# EasyEDA Pro project ProPrj_40HZ-AMSAD_2024-06-22.epro

# Schematic Schematic1
Create Date: 2024-05-20; Page Name: P1; Project Name: 阿尔法波平板; Schematic Name: Schematic1; Update Date: 2024-05-21; Company: 嘉立创EDA; Page Size: A4; Version: V1.0
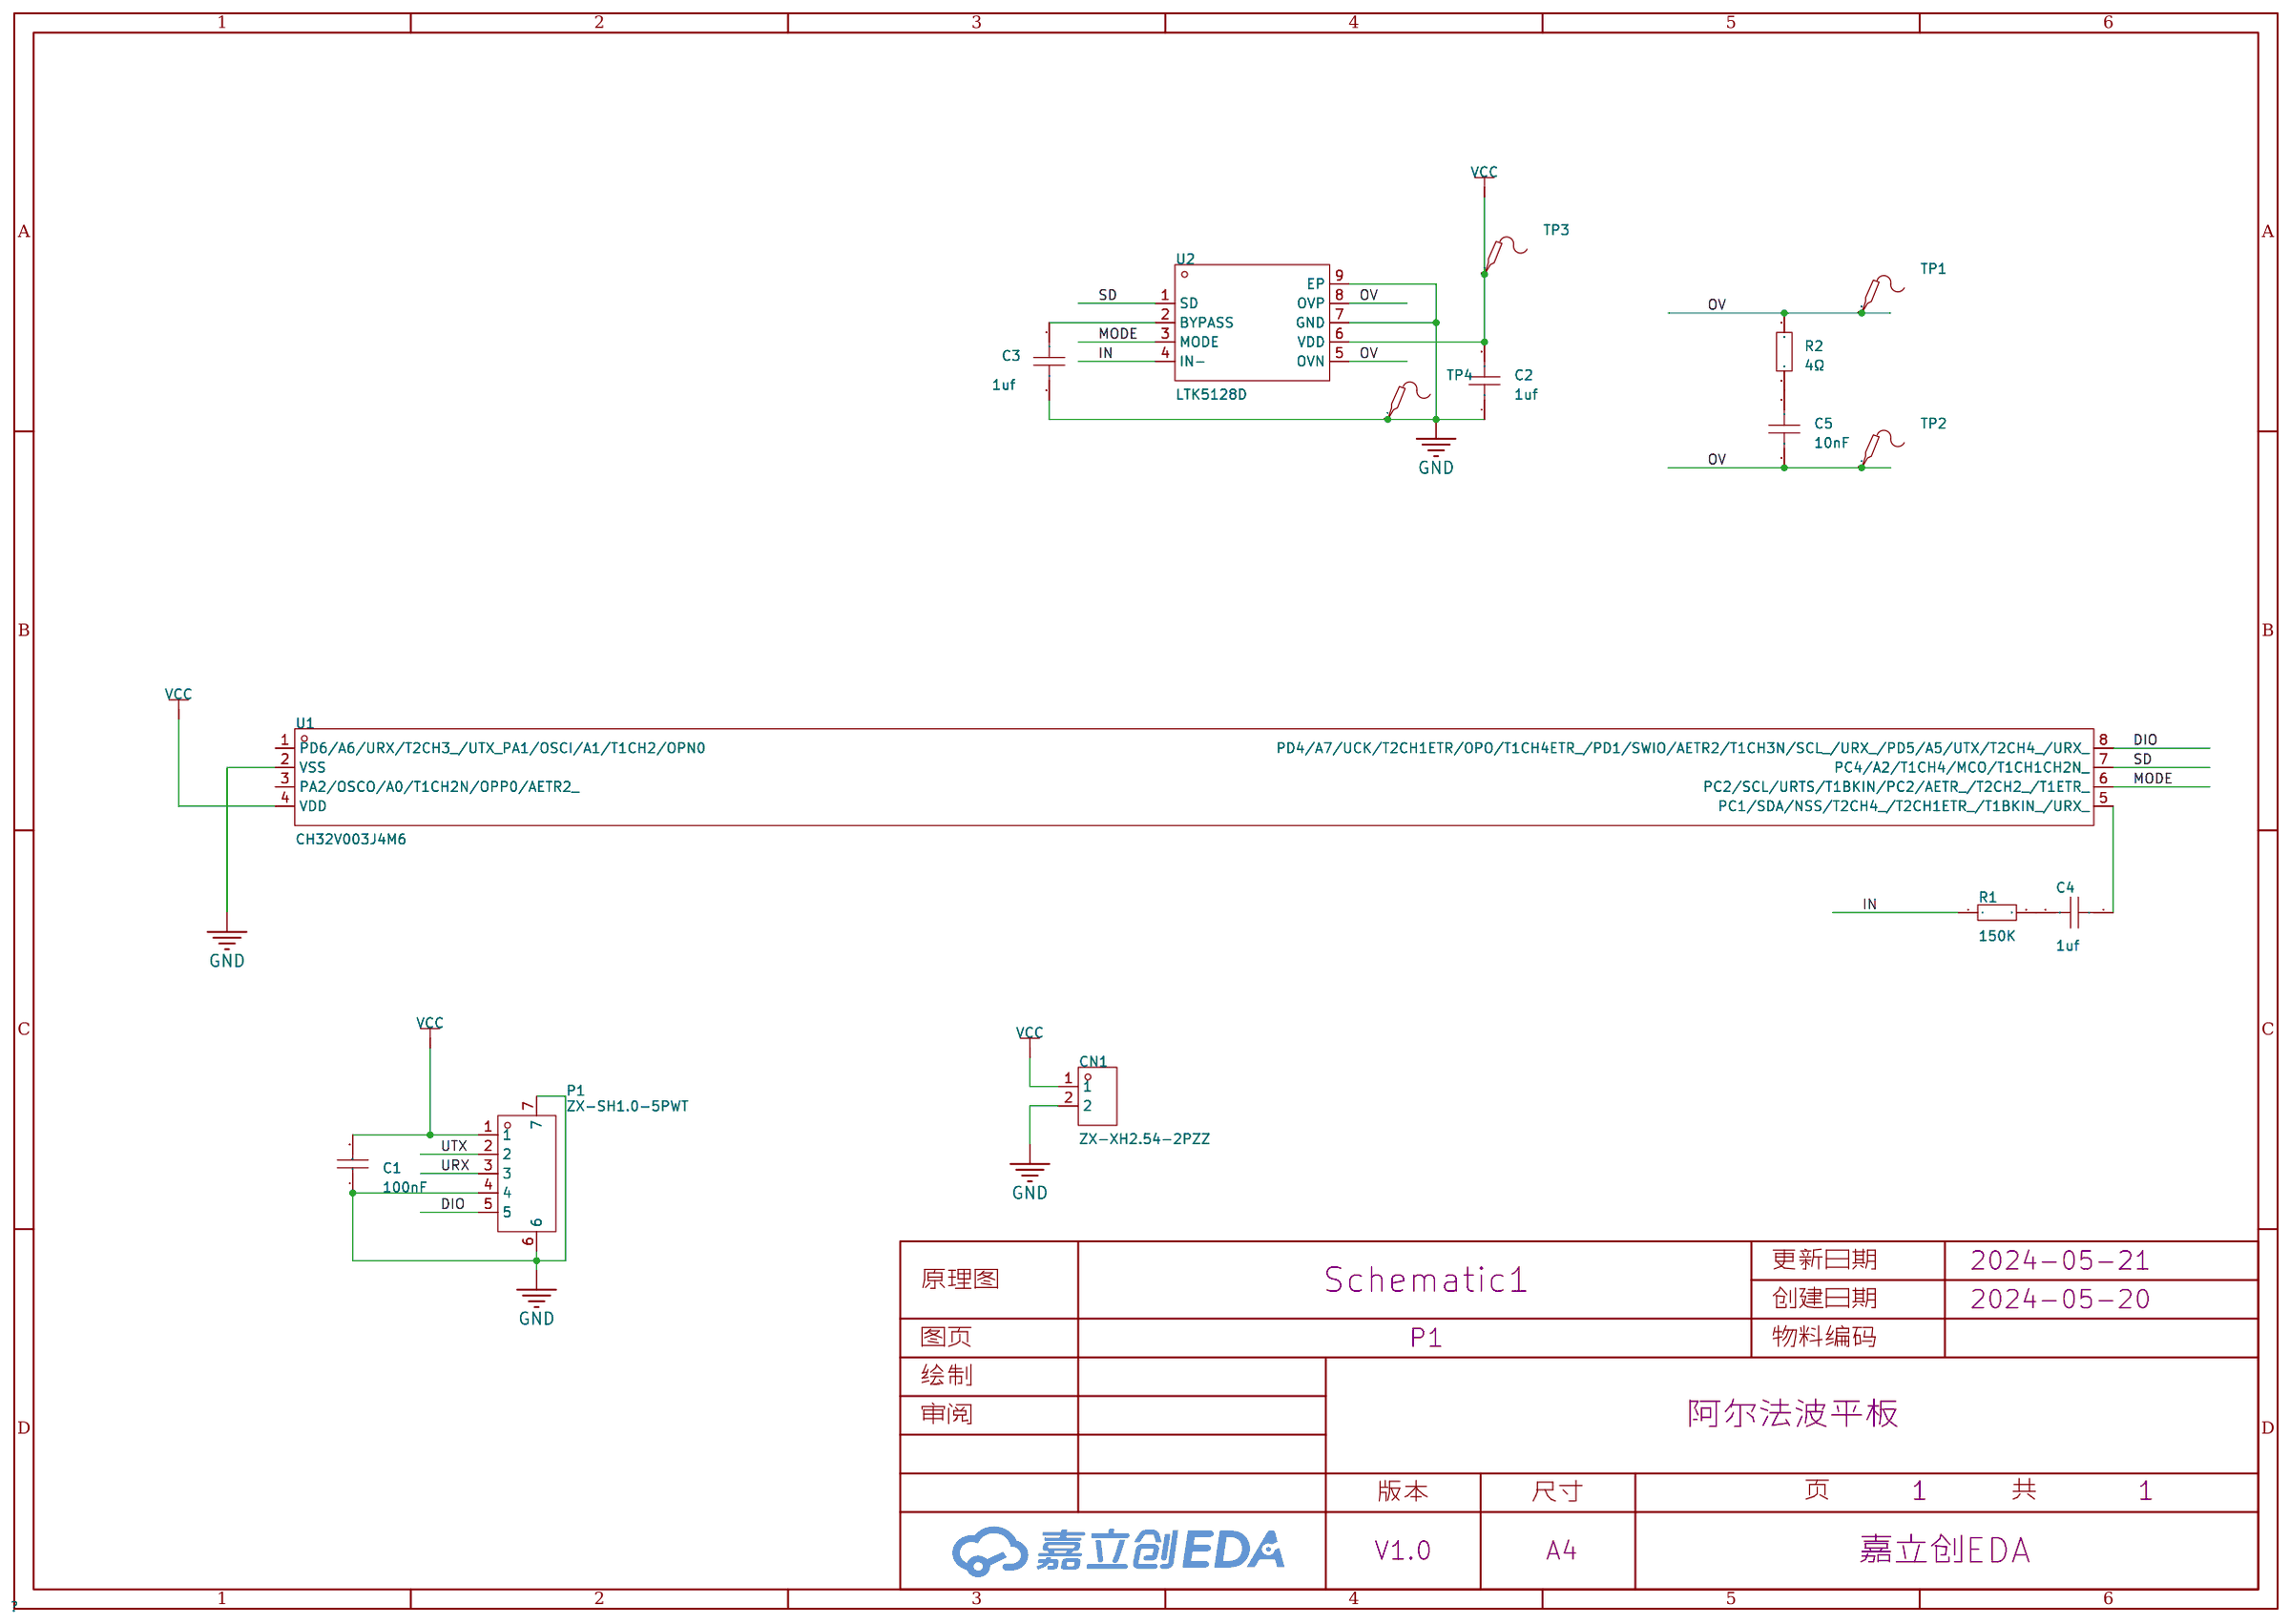
[diagram p0: schematic sheet]

## Parts
C1  100nF  [C0603]
C2  1uf  [C0603]
C3  1uf  [C0603]
C4  1uf  [C0603]
C5  10nF  [C0603]
CN1  ZX-XH2.54-2PZZ  [CONN-TH_2P-P2.50_HX25003-2A]
P1  ZX-SH1.0-5PWT  [CONN-SMD_5P-P1.00_MEGASTAR_ZX-SH1.0-5PWT]
R1  150K  [R0603]
R2  4Ω  [R0603]
TP1  -  [Test-Point-0.5mm]
TP2  -  [Test-Point-0.5mm]
TP3  -  [Test-Point-0.5mm]
TP4  -  [Test-Point-0.5mm]
U1  CH32V003J4M6  [SOP-8_L4.9-W3.8-P1.27-LS6.0-BL]
U2  LTK5128D  [ESOP-8_L4.9-W3.9-P1.27-LS6.0-BL-EP]

## Library data of the parts
C1 = 0603B104K500NT: 容值:100nF;精度:±10%;额定电压:50V;材质(温度系数):X7R;; LCSC Part Name: 100nF ±10% 50V; Supplier Part: C30926; Manufacturer: FH(风华); Supplier Footprint: 0603; JLCPCB Part Class: 扩展库; Datasheet: https://atta.szlcsc.com/upload/public/pdf/source/20200305/C486355_26A10D38EF8C2A5C37091D0039909270.pdf; Supplier: LCSC; Tolerance: ±10%; Voltage Rated: 50V; Temperature Coefficient: X7R
C2-C5 = CAP_0603: Supplier Footprint: 0603
CN1 = ZX-XH2.54-2PZZ: 插针结构:1x2P;间距:2.54mm;安装方式:直插;参考系列:XH;总PIN数:2P;排数:1;每排PIN数:2;行距:-;额定电流:3A;触头材质:黄铜;触头镀层:锡;工作温度范围:-25℃~+85℃;; Supplier Part: C7429632; Manufacturer: Megastar(兆星); Supplier Footprint: 插件,P=2.54mm; JLCPCB Part Class: 扩展库; Datasheet: https://atta.szlcsc.com/upload/public/pdf/source/20230619/19BA6947230AA44A04D3EDD65E618FD0.pdf; Supplier: LCSC; Pins Structure: 1x2P; Pitch: 2.54mm; Mounting Style: 直插; Reference Series: XH; Number of Pins: 2P; Number of Rows: 1; Number of PINs Per Row: 2; Current Rating (Max): 3A; Contact Material: 黄铜; Contact Plating: 锡; Operating Temperature Range: -25℃~+85℃
P1 = ZX-SH1.0-5PWT: 插针结构:1x5P;间距:1mm;安装方式:卧贴;参考系列:SH;总PIN数:5P;排数:1;每排PIN数:5;行距:-;额定电流:1A;触头材质:黄铜;触头镀层:锡;工作温度范围:-25℃~+85℃;; Supplier Part: C7430447; Manufacturer: Megastar(兆星); Supplier Footprint: SMD,P=1mm,卧贴; JLCPCB Part Class: 扩展库; Datasheet: https://atta.szlcsc.com/upload/public/pdf/source/20230619/A00B60466F49A3581AA01BB47452619D.pdf; Supplier: LCSC; Pins Structure: 1x5P; Pitch: 1mm; Mounting Style: 卧贴; Reference Series: SH; Number of Pins: 5P; Number of Rows: 1; Number of PINs Per Row: 5; Current Rating (Max): 1A; Contact Material: 黄铜; Contact Plating: 锡; Operating Temperature Range: -25℃~+85℃
R1 R2 = Res_0603: Supplier Footprint: 0603
TP1-TP4 = Test-Point: Test Point 测试点
U1 = CH32V003J4M6_C5346354: Supplier Part: C5346354; Manufacturer: WCH(南京沁恒); Supplier Footprint: SOP-8; JLCPCB Part Class: 扩展库; Datasheet: https://atta.szlcsc.com/upload/public/pdf/source/20230330/2B4114C2A4D5CCDA66281B491480BF55.pdf; Supplier: LCSC
U2 = LTK5128D: 功放类型:-;输出功率:-;; Supplier Part: C406244; Manufacturer: LTKCHIP(联辉科); Supplier Footprint: ESOP-8; JLCPCB Part Class: 扩展库; Datasheet: https://atta.szlcsc.com/upload/public/pdf/source/20200113/C406244_46B728B10C7D009463CA2693F6B24B0E.pdf; Supplier: LCSC

## Nets
GND: C1.1 C2.1 C3.1 CN1.2 P1.4 P1.6 P1.7 TP4.1 U1.2(VSS) U2.7(GND) U2.9(EP)
VCC: C1.2 C2.2 CN1.1 P1.1 TP3.1 U1.4(VDD) U2.6(VDD)
DIO: P1.5 U1.8(PD4/A7/UCK/T2CH1ETR/OPO/T1CH4ETR_/PD1/SWIO/AETR2/T1CH3N/SCL_/URX_/PD5/A5/UTX/T2CH4_/URX_)
IN: R1.1 U2.4(IN-)
MODE: U1.6(PC2/SCL/URTS/T1BKIN/PC2/AETR_/T2CH2_/T1ETR_) U2.3(MODE)
OV: C5.1 R2.2 TP1.1 TP2.1 U2.5(OVN) U2.8(OVP)
SD: U1.7(PC4/A2/T1CH4/MCO/T1CH1CH2N_) U2.1(SD)
URX: P1.3
UTX: P1.2
$1N468: C3.2 U2.2(BYPASS)
$1N596: C4.1 U1.5(PC1/SDA/NSS/T2CH4_/T2CH1ETR_/T1BKIN_/URX_)
$1N669: C4.2 R1.2
$1N795: C5.2 R2.1

Not connected (* = marked no-connect by the designer): U1 1(PD6/A6/URX/T2CH3_/UTX_PA1/OSCI/A1/T1CH2/OPN0) 3(PA2/OSCO/A0/T1CH2N/OPP0/AETR2_)

# Board PCB1
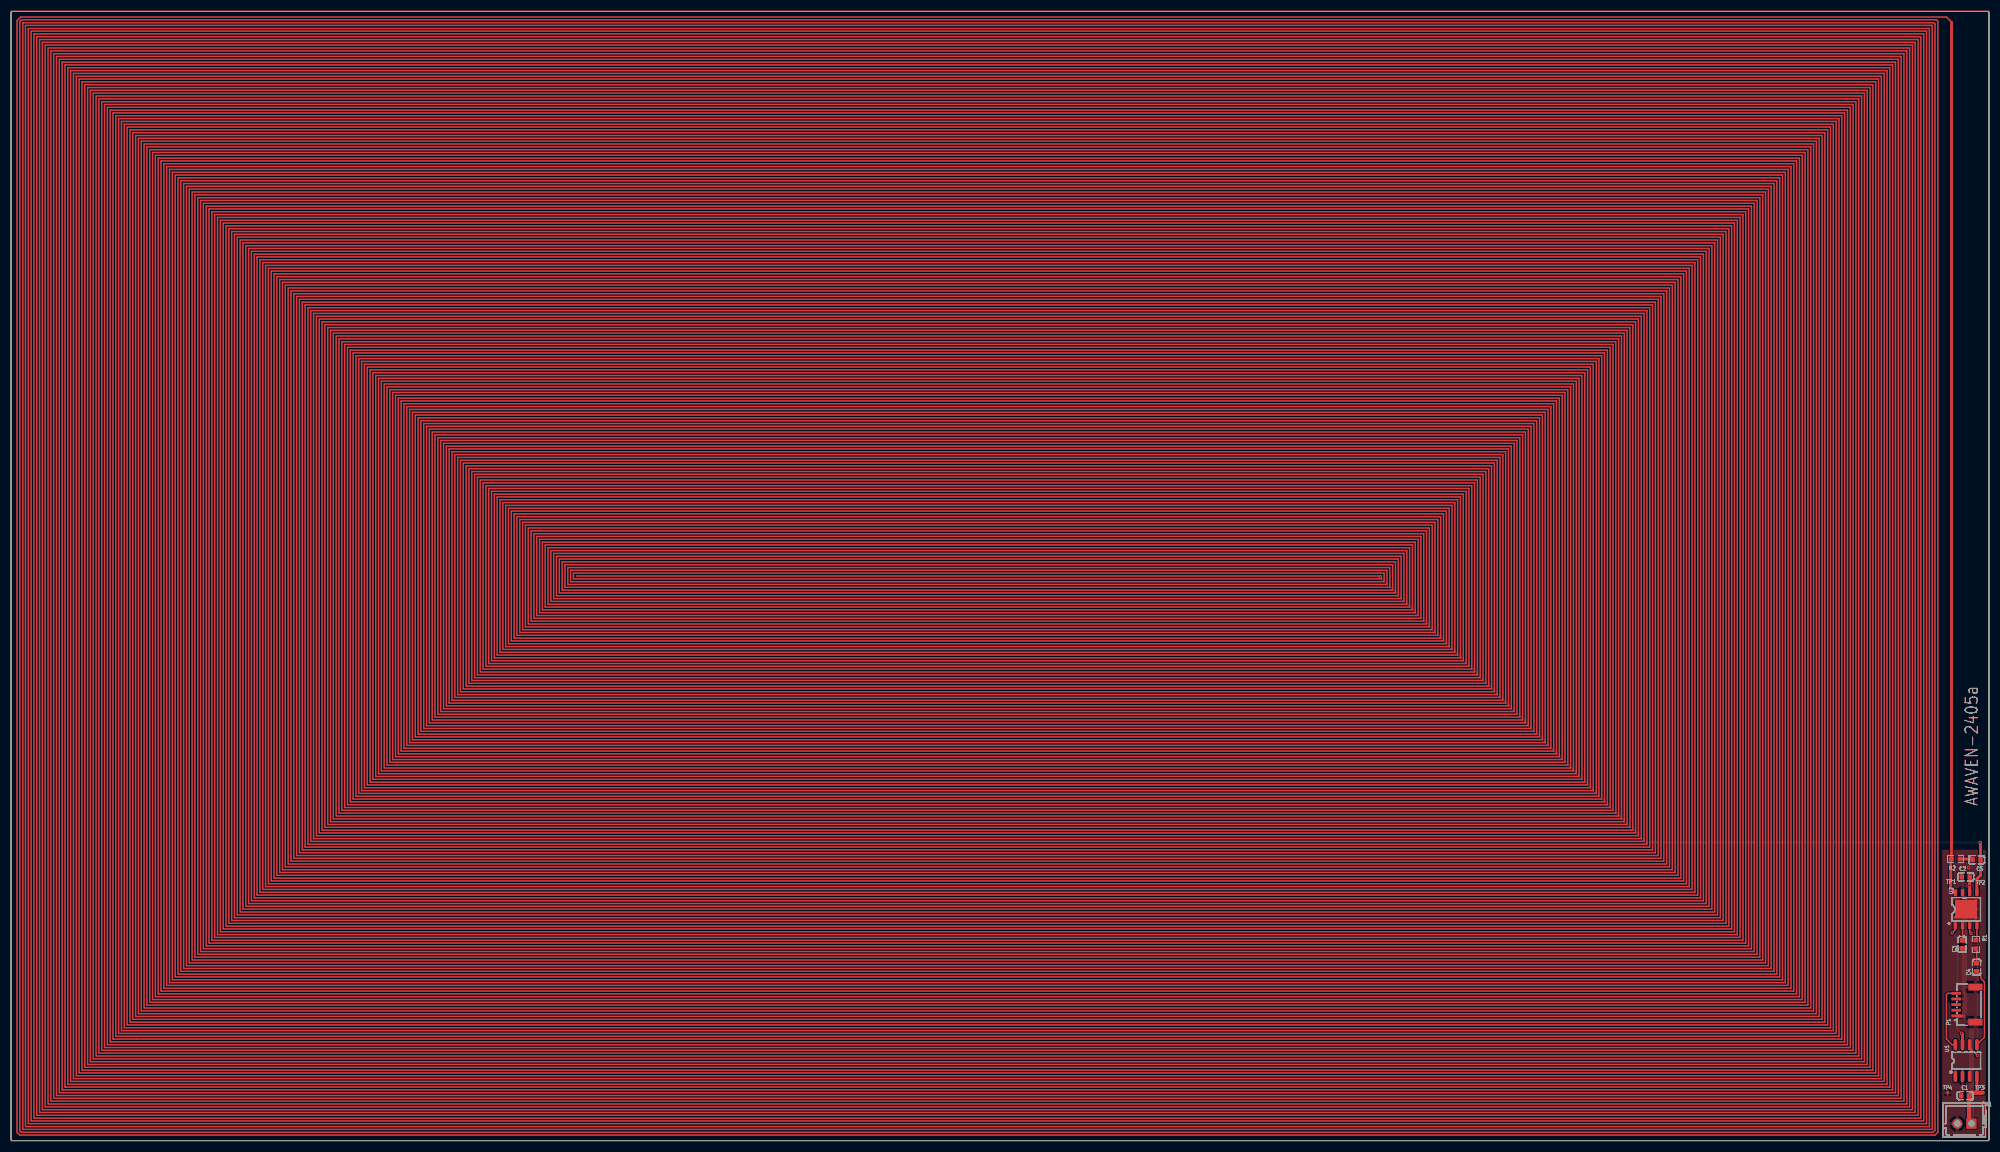
[diagram p1: board, top side]
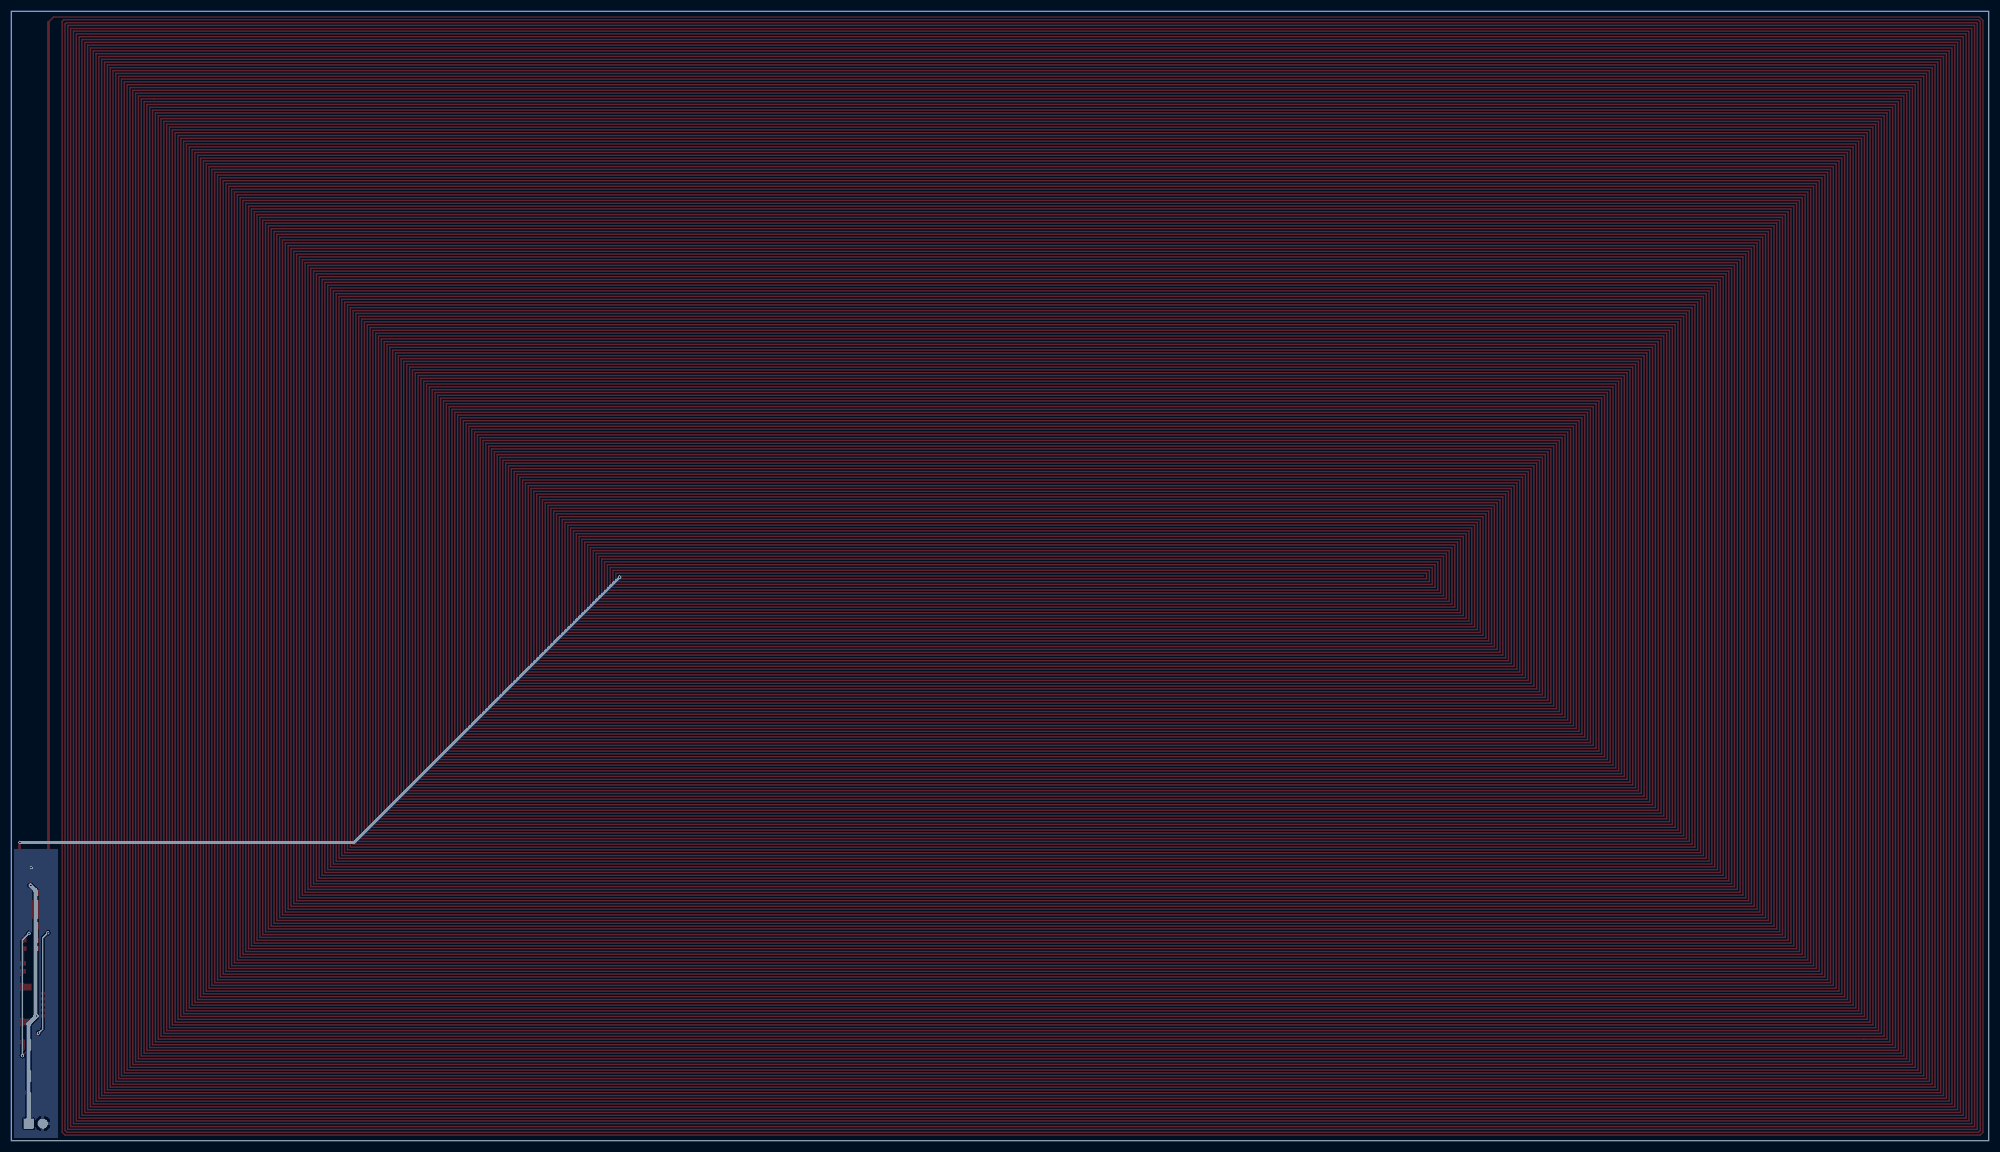
[diagram p2: board, bottom side, seen from below]

Outline 350 x 200 mm; copper layers: Top Layer, Bottom Layer. Coordinates in mm from the lower left corner of the outline.
Outline path: rectangle 0,200 350,0
Stack: Top Layer 0.035mm / Dielectric1 1.51mm FR4 er 4.5 / Bottom Layer 0.035mm

## Design rules (mm)
template: JLCPCB Capability(Two Layers Board)
spacing copperThickness1oz (default): track to track 0.102, other pairs 0.152 to 0.3
spacing copperThickness2oz: track to track 0.203, other pairs 0.152 to 0.3
track width copperThickness1oz (default): min 0.127, default 0.254, max 2.54
track width copperThickness2oz: min 0.203, default 0.254, max 2.54
differential pair differentialPair (default): width min 0.127, default 0.254, max 2.54; gap min 0.152, default 0.152
via viaSize (default): diameter min 0.5, default 0.61, max 10; hole min 0.3, default 0.305, max 6.3
net VCC uses copperThickness2oz

## Placement (name value [footprint] x y rotation side)
C1  100nF  [C0603]  345.82 7.98 0 top
C2  1uf  [C0603]  345.95 46.71 0 top
C3  1uf  [C0603]  345.31 34.77 90 top
C4  1uf  [C0603]  347.85 30.71 90 top
C5  10nF  [C0603]  347.85 49.76 180 top
CN1  ZX-XH2.54-2PZZ  [CONN-TH_2P-P2.50_HX25003-2A]  345.69 3.02 180 top
P1  ZX-SH1.0-5PWT  [CONN-SMD_5P-P1.00_MEGASTAR_ZX-SH1.0-5PWT]  345.95 24.1 90 top
R1  150K  [R0603]  347.73 34.77 270 top
R2  4Ω  [R0603]  344.17 49.89 180 top
TP1  -  [Test-Point-0.5mm]  343.28 47 0 top
TP2  -  [Test-Point-0.5mm]  348.62 47 0 top
TP3  -  [Test-Point-0.5mm]  348.95 8.5 0 top
TP4  -  [Test-Point-0.5mm]  342.73 8.5 0 top
U1  CH32V003J4M6  [SOP-8_L4.9-W3.8-P1.27-LS6.0-BL]  346 14.2 0 top
U2  LTK5128D  [ESOP-8_L4.9-W3.9-P1.27-LS6.0-BL-EP]  346 41 0 top

## Footprints (pads in the part's own frame, mm; a bottom-side part is the same pattern mirrored in y, then rotated)
C0603
  rect 0.8x0.9 smd: 1(-0.7,0) 2(0.7,0)
CONN-SMD_5P-P1.00_MEGASTAR_ZX-SH1.0-5PWT
  rect 0.5x1.7 smd: 1(-2,1.7) 2(-1,1.7) 3(0,1.7) 4(1,1.7) 5(2,1.7)
  rect 1.2x2.5 smd: 6(3.1,-1.7) 7(-3.1,-1.7)
CONN-TH_2P-P2.50_HX25003-2A
  rect 1.8x1.8 hole 1.1: 1(-1.25,0)
  round 1.8 hole 1.1: 2(1.25,0)
ESOP-8_L4.9-W3.9-P1.27-LS6.0-BL-EP
  rect 0.6x1.2 smd: 1(-1.905,-2.909) 2(-0.635,-2.909) 3(0.635,-2.909) 4(1.905,-2.909) 5(1.905,2.909) 6(0.635,2.909) 7(-0.635,2.909) 8(-1.905,2.909)
  rect 3.3x2.4 smd: 9(0,0)
R0603
  rect 0.806x0.864 smd: 1(-0.753,0) 2(0.753,0)
SOP-8_L4.9-W3.8-P1.27-LS6.0-BL
  oval 0.65x2.032 smd: 1(-1.905,-2.796) 2(-0.635,-2.796) 3(0.635,-2.796) 4(1.905,-2.796) 5(1.905,2.796) 6(0.635,2.796) 7(-0.635,2.796) 8(-1.905,2.796)
Test-Point-0.5mm
  round 0.5 smd: 1(0,0)

## Nets
As in the schematic.

Pads without a net: U1 1 3

## Via types
v1: diameter 0.61, hole 0.305, Top Layer to Bottom Layer, 9 vias

## Routing (per net, layer and track width the routed paths; a pad name or vN(x,y) marks a point on that pad's centre or on a via; arc(x,y) is an arc through that point)
GND: length 14.5
  Top Layer w0.5: 347.73,42.52 347.73,39.47 347.6,39.6 344.17,39.6 344.3,39.73 344.3,42.39 347.35,42.39 347.35,42.34 U2.9
  vias: v1(346.46,48.36)
VCC: length 57.6
  Top Layer w0.5: C2.2 346.63,46.7 U2.6 ; U1.4 347.9,8.5 ; v1(345.57,22.07) 344.66,22.07 344.63,22.1
  Top Layer w0.75: CN1.1 346.52,3.45 C1.2 347.05,8.5 TP3.1
  Bottom Layer w0.75: v1(346.58,45.19) 345.71,44.31 345.71,22.21 v1(345.57,22.07) 346.94,20.7 CN1.1
DIO: length 11.7
  Top Layer w0.254: U1.8 343.53,17 342.52,18.01 342.52,25.85 342.77,26.1 P1.5
IN: length 2.6
  Top Layer w0.254: U2.4 347.9,35.71 R1.1
MODE: length 26.1
  Top Layer w0.254: U2.3 346.63,36.94 v1(346.87,36.71) ; U1.6 346.63,16.45 v1(348.03,15.06)
  Bottom Layer w0.254: v1(346.87,36.71) 348.03,35.55 v1(348.03,15.06)
OV: length 135466.6
  Top Layer w0.254: 3.5,3.5 338.45,3.5 ; 340.74,198.5 1.8,198.5 1.5,198.2 1.5,1.78 1.78,1.5 ; 5.08,195 337.5,195 337.5,4.5 ; 338.5,195.94 338.5,3.5 ; 245.5,102.97 245.5,96.5 96.5,96.5 96.5,103.5 246,103.5 246,96 96,96 96,104 246.5,104 246.5,95.5 95.5,95.5 95.5,104.5 247,104.5 247,95 95,95 95,105 247.5,105 247.5,94.5 94.5,94.5 94.5,105.5 248,105.5 248,94 94,94 94,106 248.5,106 248.5,93.5 93.5,93.5 93.5,106.5 249,106.5 249,93 93,93 93,107 249.5,107 249.5,92.5 92.5,92.5 92.5,107.5 250,107.5 250,92 92,92 92,108 250.5,108 250.5,91.5 91.5,91.5 91.5,108.5 251,108.5 251,91 91,91 91,109 251.5,109 251.5,90.5 90.5,90.5 90.5,109.5 252,109.5 252,90 90,90 90,110 252.5,110 252.5,89.5 89.5,89.5 89.5,110.5 253,110.5 253,89 89,89 89,111 253.5,111 253.5,88.5 88.5,88.5 88.5,111.5 254,111.5 254,88 88,88 88,112 254.5,112 254.5,87.5 87.5,87.5 87.5,112.5 255,112.5 255,87 87,87 87,113 255.5,113 255.5,86.5 86.5,86.5 86.5,113.5 256,113.5 256,86 86,86 86,114 256.5,114 256.5,85.5 85.5,85.5 85.5,114.5 257,114.5 257,85 85,85 85,115 257.5,115 257.5,84.5 84.5,84.5 84.5,115.5 258,115.5 258,84 84,84 84,116 258.5,116 258.5,83.5 83.5,83.5 83.5,116.5 259,116.5 259,83 83,83 83,117 259.5,117 259.5,82.5 82.5,82.5 82.5,117.5 260,117.5 260,82 82,82 82,118 260.5,118 260.5,81.5 81.5,81.5 81.5,118.5 261,118.5 261,81 81,81 81,119 261.5,119 261.5,80.5 80.5,80.5 80.5,119.5 262,119.5 262,80 80,80 80,120 262.5,120 262.5,79.5 79.5,79.5 79.5,120.5 263,120.5 263,79 79,79 79,121 263.5,121 263.5,78.5 78.5,78.5 78.5,121.5 264,121.5 264,78 78,78 78,122 264.5,122 264.5,77.5 77.5,77.5 77.5,122.5 265,122.5 265,77 77,77 77,123 265.5,123 265.5,76.5 76.5,76.5 76.5,123.5 266,123.5 266,76 76,76 76,124 266.5,124 266.5,75.5 75.5,75.5 75.5,124.5 267,124.5 267,75 75,75 75,125 267.5,125 267.5,74.5 74.5,74.5 74.5,125.5 268,125.5 268,74 74,74 74,126 268.5,126 268.5,73.5 73.5,73.5 73.5,126.5 269,126.5 269,73 73,73 73,127 269.5,127 269.5,72.5 72.5,72.5 72.5,127.5 270,127.5 270,72 72,72 72,128 270.5,128 270.5,71.5 71.5,71.5 71.5,128.5 271,128.5 271,71 71,71 71,129 271.5,129 271.5,70.5 70.5,70.5 70.5,129.5 272,129.5 272,70 70,70 70,130 272.5,130 272.5,69.5 69.5,69.5 69.5,130.5 273,130.5 273,69 69,69 69,131 273.5,131 273.5,68.5 68.5,68.5 68.5,131.5 274,131.5 274,68 68,68 68,132 274.5,132 274.5,67.5 67.5,67.5 67.5,132.5 275,132.5 275,67 67,67 67,133 275.5,133 275.5,66.5 66.5,66.5 66.5,133.5 276,133.5 276,66 66,66 66,134 276.5,134 276.5,65.5 65.5,65.5 65.5,134.5 277,134.5 277,65 65,65 65,135 277.5,135 277.5,64.5 64.5,64.5 64.5,135.5 278,135.5 278,64 64,64 64,136 278.5,136 278.5,63.5 63.5,63.5 63.5,136.5 279,136.5 279,63 63,63 63,137 279.5,137 279.5,62.5 62.5,62.5 62.5,137.5 280,137.5 280,62 62,62 62,138 280.54,138 280.54,61.5 61.5,61.5 61.5,138.5 281,138.5 281,61 61,61 61,139 281.5,139 281.5,60.5 60.5,60.5 60.5,139.5 282,139.5 282,60 60,60 60,140 282.5,140 282.5,59.5 59.5,59.5 59.5,140.5 283,140.5 283,59 59,59 59,141 283.5,141 283.5,58.5 58.5,58.5 58.5,141.5 284,141.5 284,58 58,58 58,142 284.5,142 284.5,57.5 57.5,57.5 57.5,142.5 285,142.5 285,57 57,57 57,143 285.5,143 285.5,56.5 56.5,56.5 56.5,143.5 286,143.5 286,56 56,56 56,144 286.5,144 286.5,55.5 55.5,55.5 55.5,144.5 287,144.5 287,55 54.99,55 55,145 287.5,145 287.5,54.5 54.5,54.5 54.5,145.5 288,145.5 288,54 54,54 54,146 288.5,146 288.5,53.5 53.5,53.5 53.5,146.5 289,146.5 289,53 53,53 53,147 289.5,147 289.5,52.5 52.5,52.5 52.5,147.5 290,147.5 290,52 52,52 52,148 290.5,148 290.5,51.5 51.5,51.5 51.5,148.5 291,148.5 291,51 51,51 51,149 291.5,149 291.5,50.5 50.5,50.5 50.5,149.5 292,149.5 292,50 50,50 50,150 292.5,150 292.5,49.5 49.5,49.5 49.5,150.5 293,150.5 293,49 49,49 49,151 293.5,151 293.5,48.5 48.5,48.5 48.5,151.5 294,151.5 294,48 48,48 48,152 294.5,152 294.5,47.5 47.5,47.5 47.5,152.5 295,152.5 295,47 47,47 47,153 295.5,153 295.5,46.5 46.5,46.5 46.5,153.5 296,153.5 296,46 46,46 46,154 296.5,154 296.5,45.5 45.5,45.5 45.5,154.5 297,154.5 297,45 45,45 45,155 297.5,155 297.5,44.5 44.5,44.5 44.5,155.5 298,155.5 298,44 44,44 44,156 298.5,156 298.5,43.5 43.5,43.5 43.5,156.5 299,156.5 299,43 43,43 43,157 299.5,157 299.5,42.5 42.5,42.5 42.5,157.5 300,157.5 300,42 42,42 42,158 300.5,158 300.5,41.5 41.5,41.5 41.5,158.5 301,158.5 301,41 41,41 41,159 301.5,159 301.5,40.5 40.5,40.5 40.5,159.5 302,159.5 302,40 40,40 40,160 302.5,160 302.5,39.5 39.5,39.5 39.5,160.5 303,160.5 303,39 39,39 39,161 303.5,161 303.5,38.5 38.5,38.5 38.5,161.5 304,161.5 304,38 38,38 38,162 304.5,162 304.5,37.5 37.5,37.5 37.5,162.5 305,162.5 305,37 37,37 37,163 305.5,163 305.5,36.5 36.5,36.5 36.5,163.5 306,163.5 306,36 36,36 36,164 306.5,164 306.5,35.5 35.5,35.5 35.5,164.5 307,164.5 307,35 35,35 35,165 307.5,165 307.5,34.5 34.5,34.5 34.5,165.5 308,165.5 308,34 34,34 34,166 308.5,166 308.5,33.5 33.5,33.5 33.5,166.5 309,166.5 309,33 33,33 33,167 309.5,167 309.5,32.5 32.5,32.5 32.5,167.5 310,167.5 310,32 32,32 32,168 310.5,168 310.5,31.5 31.5,31.5 31.5,168.5 311,168.5 311,31 31,31 31,169 311.5,169 311.5,30.5 30.5,30.5 30.5,169.5 312,169.5 312,30 30,30 30,170 312.5,170 312.5,29.5 29.5,29.5 29.5,170.5 313,170.5 313,29 29,29 29,171 313.5,171 313.5,28.5 28.5,28.5 28.5,171.5 314,171.5 314,28 28,28 28,172 314.5,172 314.5,27.5 27.5,27.5 27.5,172.5 315,172.5 315,27 27,27 27,173 315.5,173 315.5,26.5 26.5,26.5 26.5,173.5 316,173.5 316,26 26,26 26,174 316.5,174 316.5,25.5 25.5,25.5 25.5,174.5 317,174.5 317,25 25,25 25,175 317.5,175 317.5,24.5 24.5,24.5 24.5,175.5 318,175.5 318,24 24,24 24,176 318.5,176 318.5,23.5 23.5,23.5 23.5,176.5 319,176.5 319,23 23,23 23,177 319.5,177 319.5,22.5 22.5,22.5 22.5,177.5 320,177.5 320,22 22,22 22,178 320.5,178 320.5,21.5 21.5,21.5 21.5,178.5 321,178.5 321,21 21,21 21,179 321.5,179 321.5,20.5 20.5,20.5 20.5,179.5 322,179.5 322,20 20,20 20,180 322.5,180 322.5,19.5 19.5,19.5 19.5,180.5 323,180.5 323,19 19,19 19,181 323.5,181 323.5,18.5 18.5,18.5 18.5,181.5 324,181.5 324,18 22.1,18 ; 245.5,102.97 245.47,103 97,103 97,97 245,97 245,102.5 97.5,102.5 97.5,97.5 244.5,97.5 244.5,102 98,102 98,98 244,98 244,101.5 98.5,101.5 98.5,98.5 243.5,98.5 243.5,101 99,101 99,99 243,99 243,100.5 99.5,100.5 99.5,99.5 242.5,99.5 242.5,100 100,100 ; 245.5,102.97 245.5,103 ; 22.1,18 18,18 18,182 324.5,182 324.5,17.5 17.5,17.5 17.5,182.5 325,182.5 325,17 17,17 17,183 325.5,183 325.5,16.5 16.5,16.5 16.5,183.5 326,183.5 326,16 16,16 16,184 326.5,184 326.5,15.5 15.5,15.5 15.5,184.5 324.75,184.5 ; 22.1,18 22.1,18.01 ; 338.5,196 4.06,196 4,195.94 4,4 ; 335,192.5 7.5,192.5 ; 335,192.5 335,7 7,7 ; 335,192.5 335,192.51 ; 7.5,192.5 7.49,192.5 ; 7.5,192.5 7.5,7.5 334.5,7.5 334.5,192 8,192 8,8 334,8 ; 343.42,198.09 342.52,198.98 1.65,198.98 1.02,198.35 1.02,1.5 1.52,1 340.5,1 341,1.5 341,198.22 340.74,198.48 ; 339.5,2.5 339.5,196.95 3,196.95 3,3.02 339,3.02 339,196.5 3.6,196.5 3.5,196.4 3.5,3.53 ; 331,188.5 11.5,188.5 11.5,11.5 330.5,11.5 330.5,188 12,188 12,12 330,12 330,187.5 12.5,187.5 12.5,12.5 329.5,12.5 329.5,187 13,187 13,13 329,13 329,186.5 13.5,186.5 13.5,13.5 328.5,13.5 328.5,186 14,186 14,14 328,14 328,185.5 14.5,185.5 14.5,14.5 327.5,14.5 327.5,185 15,185 15,15 327,15 327,184.5 324.75,184.5 ; 7,7.09 7,193 335.5,193 ; 336.93,5 5,5 5,195 ; 324.75,184.5 324.74,184.51 ; 334,8 334,191.5 8.5,191.5 8.5,8.5 333.5,8.5 333.5,191 9,191 9,9 333,9 333,190.5 9.52,190.5 ; 334,8 334.01,8 ; 337.44,4.5 4.5,4.5 4.5,195.5 ; 330.96,11 11,11 11,189 ; 6,6 336,6 336,193.5 6.5,193.5 6.5,6.5 335.5,6.5 335.5,192.98 ; 10.5,10.5 331.47,10.5 ; 340.5,1.84 340.5,197.75 340.28,197.97 2.16,197.97 2.03,197.84 2.03,2.01 340,2.01 340,197.46 339.96,197.5 2.5,197.5 2.5,2.64 ; 337.99,4 337.99,195.43 337.92,195.5 4.57,195.5 ; 336.42,5.5 5.56,5.5 5.5,5.56 5.5,194.5 336.99,194.5 ; 10.5,10.52 10.5,189.5 332,189.5 332,10.02 331.98,10 10,10 ; 6,6.04 6,194.01 336.5,194.01 336.5,5.5 ; 2.5,2.5 339.47,2.5 ; 1.78,1.5 340.15,1.5 340.49,1.84 ; 331,11 331,188.44 ; 11.05,189 331.5,189 331.5,10.5 ; 9.5,190.5 9.5,9.53 9.52,9.5 332.5,9.5 332.5,190 10,190 10,10.01 ; 348.55,47 TP2.1 ; 336.99,5 336.99,194.41 ; 337.95,4 4.06,4
  Top Layer w0.5: 343.42,198.09 R2.2 343.28,49.75 TP1.1 343.28,44.72 U2.8 ; U2.5 347.9,46.35 348.55,47 C5.1 348.55,52.68
  Bottom Layer w0.5: v1(348.49,52.81) 289.31,52.81 v1(242.32,99.8)
SD: length 22.1
  Top Layer w0.254: U2.1 344.1,37.37 v1(343.54,36.81)
  Top Layer w0.5: v1(345.19,19.03) 345.37,18.85 U1.7
  Bottom Layer w0.254: v1(343.54,36.81) 344.42,35.92 344.42,19.79 v1(345.19,19.03)
$1N468: length 2.6
  Top Layer w0.254: U2.2 345.37,35.53 C3.2
$1N596: length 14.1
  Top Layer w0.254: U1.5 349.25,18.34 349.25,28.14 348.62,28.77 348.62,29.25 C4.1
$1N669: length 2.7
  Top Layer w0.254: C4.2 347.85,33.89 R1.2
$1N795: length 2.3
  Top Layer w0.5: R2.1 347.03,49.89 C5.2

## Copper pours and planes (outline as drawn; the poured copper is in the pictures)
GND on Top Layer: 341.76,51.54 350.77,51.54 350.77,-1.8 341.76,-1.8
GND on Bottom Layer: 341.76,51.66 354.58,51.66 354.58,-1.04 341.76,-1.04

## Text on the board
Top Silkscreen Layer: AWAVEN-2405a
